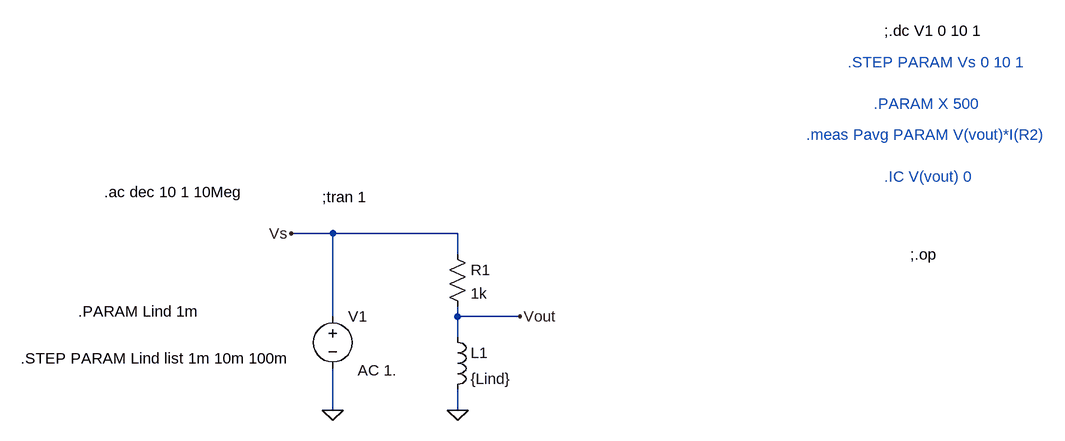
[diagram p0: schematic Training.asc]
Training.asc, the LTspice schematic file:
Version 4
SHEET 1 1176 680
WIRE 48 16 -16 16
WIRE 240 16 48 16
WIRE 240 48 240 16
WIRE 48 144 48 16
WIRE 240 144 240 128
WIRE 336 144 240 144
WIRE 240 176 240 144
WIRE 48 288 48 224
WIRE 240 288 240 256
FLAG 240 288 0
FLAG 48 288 0
FLAG -16 16 Vs
FLAG 336 144 Vout
SYMBOL res 224 32 R0
SYMATTR InstName R1
SYMATTR Value 1k
SYMBOL voltage 48 128 R0
WINDOW 3 38 99 Left 2
SYMATTR InstName V1
SYMATTR Value AC 1.
SYMBOL ind 224 160 R0
SYMATTR InstName L1
SYMATTR Value {Lind}
TEXT 32 -40 Left 2 !;tran 1
TEXT 776 -136 Left 2 ;.meas Pavg PARAM V(vout)*I(R2)
TEXT 880 -184 Left 2 ;.PARAM X 500
TEXT 896 -72 Left 2 ;.IC V(vout) 0
TEXT 896 -296 Left 2 !;.dc V1 0 10 1
TEXT 840 -248 Left 2 ;.STEP PARAM Vs 0 10 1
TEXT 936 48 Left 2 !;.op
TEXT -304 -48 Left 2 !.ac dec 10 1 10Meg
TEXT -344 136 Left 2 !.PARAM Lind 1m
TEXT -432 208 Left 2 !.STEP PARAM Lind list 1m 10m 100m

The netlist it stands for:
* Training.asc
R1 Vs Vout 1k
V1 Vs 0 AC 1.
L1 Vout 0 {Lind}
;tran 1
* .meas Pavg PARAM V(vout)*I(R2)
* .PARAM X 500
* .IC V(vout) 0
;.dc V1 0 10 1
* .STEP PARAM Vs 0 10 1
;.op
.ac dec 10 1 10Meg
.PARAM Lind 1m
.STEP PARAM Lind list 1m 10m 100m
.backanno
.end